# Altium project STM32C011F6U6TR SOM B'd.PrjPcb
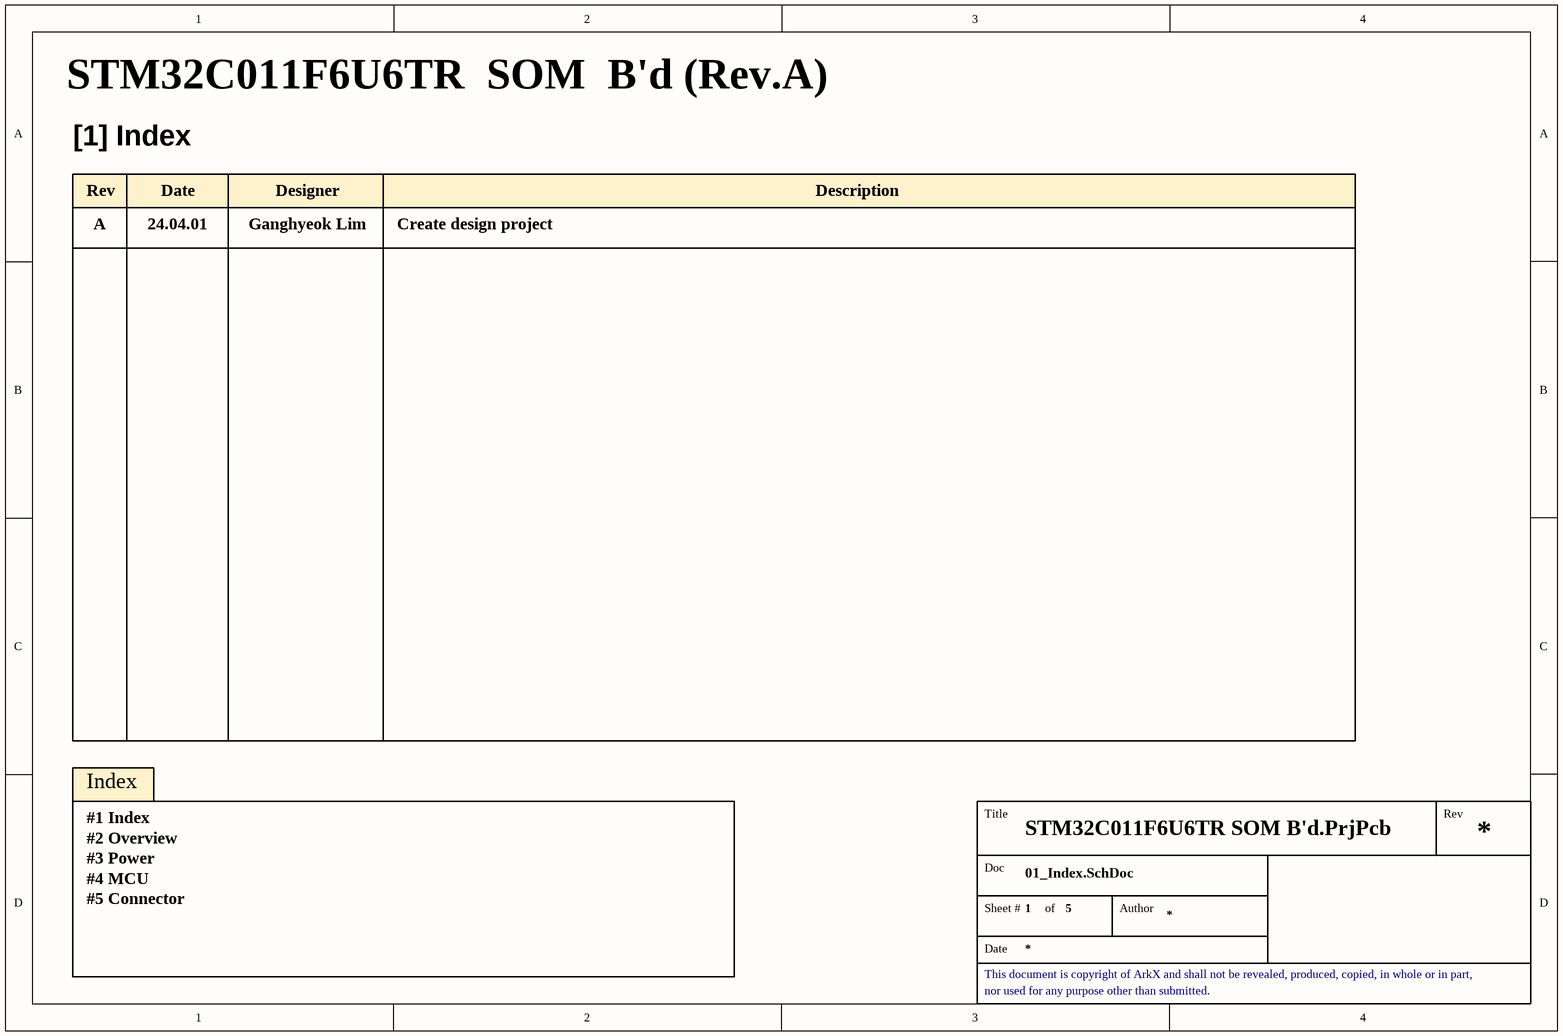
[diagram p0: 01_Index.SchDoc]
5 sheets, 42 parts. Net scope: flat (ports and power ports of the same name join across sheets).
Board file: STM32C011F6U6TR_SOM_Bd.PcbDoc
Sheets:
  01_Index.SchDoc
  02_Overview.SchDoc
  03_Power.SchDoc
  04_MCU.SchDoc
  05_Connector.SchDoc

## Sheet 01_Index.SchDoc
size A4; SheetNumber: 1; SheetTotal: 5

### Notes on the sheet
- STM32C011F6U6TR  SOM  B'd (Rev.A)
- [1] Index
- Rev
- A
- 24.04.01
- Date
- Ganghyeok Lim
- Designer
- Create design project
- Description
- Index
- #1 Index
- #2 Overview
- #3 Power
- #4 MCU
- #5 Connector
- Title
- Doc
- Sheet #
- of
- Author
- This document is copyright of ArkX and shall not be revealed, produced, copied, in whole or in part,
- nor used for any purpose other than submitted.

## Sheet 02_Overview.SchDoc
size A4; SheetNumber: 2; SheetTotal: 4
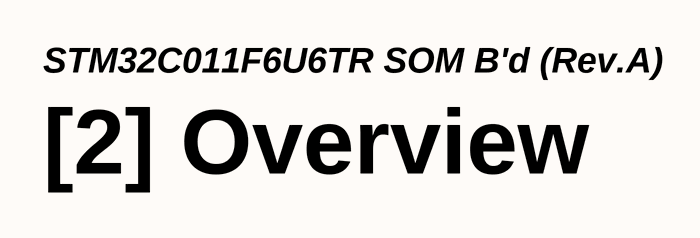
[diagram p1: 02_Overview.SchDoc]

### Notes on the sheet
- STM32C011F6U6TR SOM B'd (Rev.A)
- [2] Overview
- Title
- Rev
- Doc
- Sheet #
- of
- Author
- This document is copyright of ArkX and shall not be revealed, produced, copied, in whole or in part,
- Date
- nor used for any purpose other than submitted.

## Sheet 03_Power.SchDoc
size A4; SheetNumber: 3; SheetTotal: 5
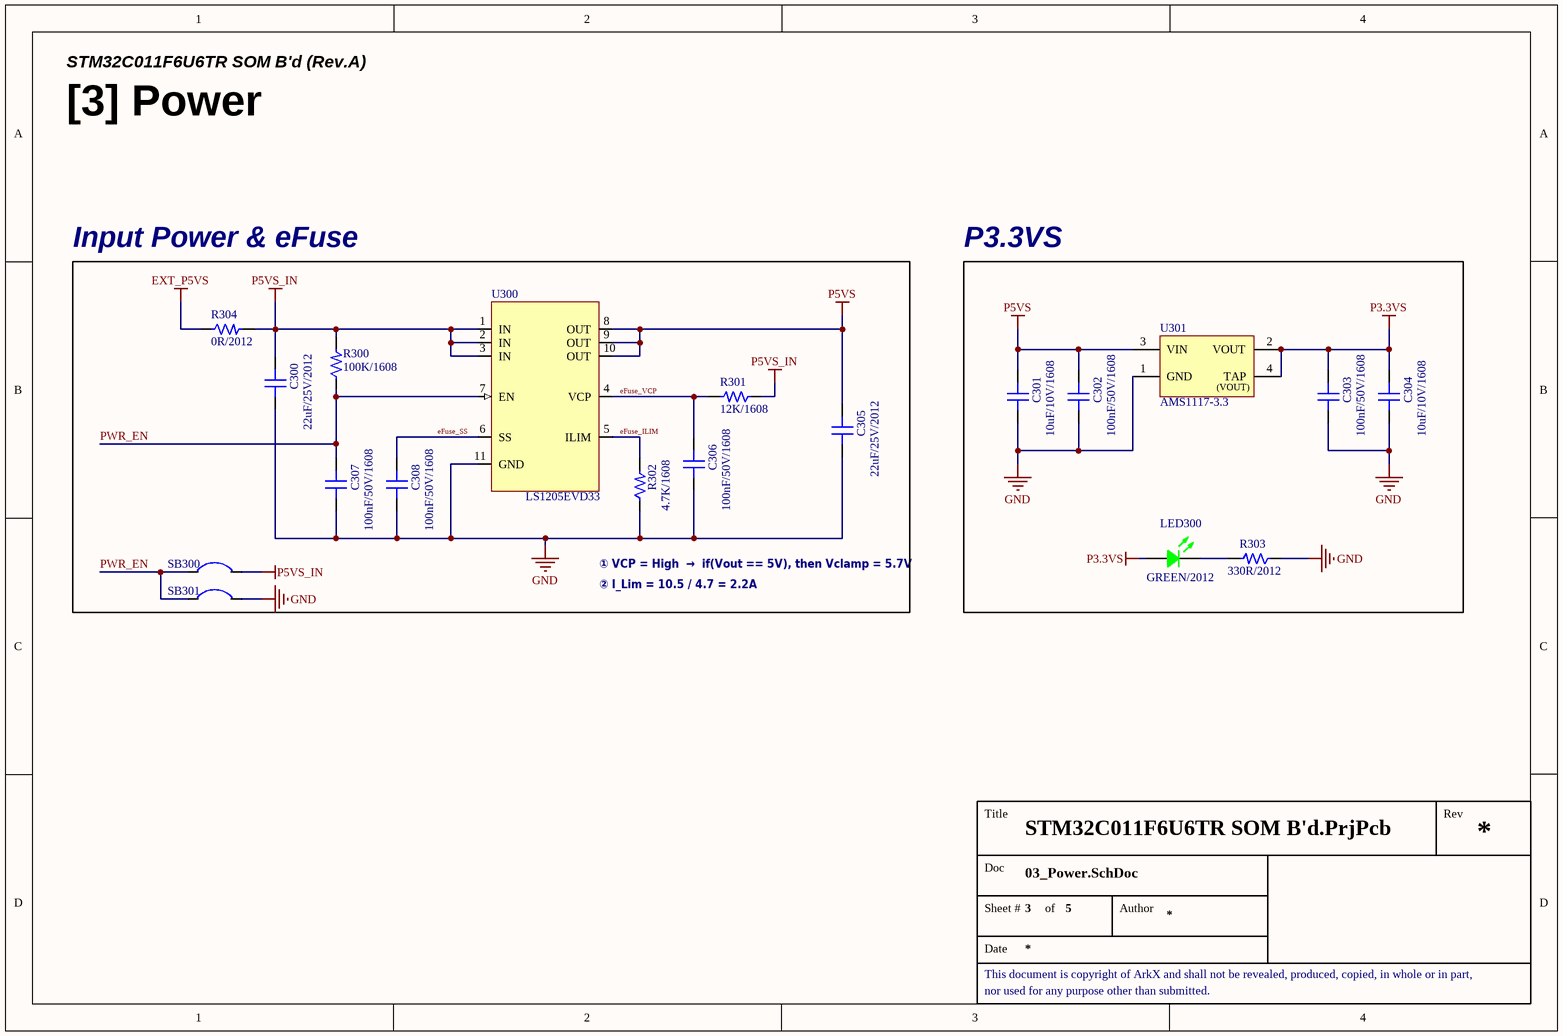
[diagram p2: 03_Power.SchDoc]

### Parts
C300  22uF/25V/2012  [CAP 2012 (0805_INCH)]
C301  10uF/10V/1608  [CAP 1608 (0603_INCH)]
C302  100nF/50V/1608  [CAP 1608 (0603_INCH)]
C303  100nF/50V/1608  [CAP 1608 (0603_INCH)]
C304  10uF/10V/1608  [CAP 1608 (0603_INCH)]
C305  22uF/25V/2012  [CAP 2012 (0805_INCH)]
C306  100nF/50V/1608  [CAP 1608 (0603_INCH)]
C307  100nF/50V/1608  [CAP 1608 (0603_INCH)]
C308  100nF/50V/1608  [CAP 1608 (0603_INCH)]
LED300  GREEN/2012  [LED MHT170RGBCT (GREEN)]
R300  100K/1608  [RES 1608 (0603_inch)]
R301  12K/1608  [RES 1608 (0603_inch)]
R302  4.7K/1608  [RES 1608 (0603_inch)]
R303  330R/2012  [RES 2012 (0805_inch)]
R304  0R/2012  [RES 2012 (0805_inch)]
SB300  SB  [SB (Solder-Bridge)]  (value not drawn)
SB301  SB  [SB (Solder-Bridge)]  (value not drawn)
U300  LS1205EVD33  [IC_DFN_3x3_10L]
U301  AMS1117-3.3  [SOT 223-3 (DIODES INCORPORATED)]

### Blocks framed on the sheet
Input Power & eFuse: C300 C305-C308 R300-R302 R304 SB300 SB301 U300
P3.3VS: C301-C304 LED300 R303 U301

### Nets
EXT_P5VS: R304.1
GND: C300.1 C301.1 C302.1 C303.1 C304.1 C305.1 C306.1 C307.1 C308.1 R302.1 R303.1 SB301.2 U300.11(GND) U301.1(GND)
P3.3VS: C303.2 C304.2 LED300.4(Common_Anode) U301.2(VOUT) U301.4(TAP)
P5VS: C301.2 C302.2 C305.2 U300.8(OUT) U300.9(OUT) U300.10(OUT) U301.3(VIN)
P5VS_IN: C300.2 R300.2 R301.1 R304.2 SB300.2 U300.1(IN) U300.2(IN) U300.3(IN)
eFuse_ILIM: R302.2 U300.5(ILIM)
eFuse_SS: C308.2 U300.6(SS)
eFuse_VCP: C306.2 R301.2 U300.4(VCP)
PWR_EN: C307.2 R300.1 SB300.1 SB301.1 U300.7(EN)
NetLED300_2: LED300.2(GREEN) R303.2

### Notes on the sheet
- STM32C011F6U6TR SOM B'd (Rev.A)
- [3] Power
- ① VCP = High  →  if(Vout == 5V), then Vclamp = 5.7V
- ② I_Lim = 10.5 / 4.7 = 2.2A
- Title
- Rev
- Doc
- Sheet #
- of
- Author
- This document is copyright of ArkX and shall not be revealed, produced, copied, in whole or in part,
- Date
- nor used for any purpose other than submitted.
- (in symbol IC_REG_AMS1117-3.3) (VOUT)

### Library data of the parts
C300 C305 = CAP_22uF/25V/2012: Ceramic CAP_22uF/25V/2012; LCSC Part #: C45783; JLCPCB Part Type: Basic Part
C301 C304 = CAP_10uF/10V/1608: Ceramic CAP_10uF/10V/1608; LCSC Part #: C19702; JLCPCB Part Type: Basic Part
C302 C303 C306-C308 = CAP_100nF/50V/1608: Ceramic CAP_100nF/50V/1608; LCSC Part #: C14663; JLCPCB Part Type: Basic Part
LED300 = LED_MHT170RGBCT(GREEN): Colorless transparence -30℃~+85℃ Positive post Common anode RGB 120° 0805  Light Emitting Diodes (LED) ROHS; LCSC Part #: C2962094; JLCPCB Part Type: Extended Part
R300 = RES_100K/1608/0.1W: Value: 100K; Power Rating: 0.1W; Precision: 1%; Size: 1608; LCSC Part #: C25803; JLCPCB Part Type: Basic Part
R301 = RES_12K/1608/0.1W: Value: 12K; Power Rating: 0.1W; Precision: 1%; Size: 1608; LCSC Part #: C22790; JLCPCB Part Type: Basic Part
R302 = RES_4.7K/1608/0.1W: Value: 4.7K; Power Rating: 0.1W; Precision: 1%; Size: 1608; LCSC Part #: C23162; JLCPCB Part Type: Basic Part
R303 = RES_330R/2012/0.125W: Value: 330R; Power Rating: 0.125W; Precision: 1%; Size: 2012; LCSC Part #: C17630; JLCPCB Part Type: Basic Part
R304 = RES_0R/2012/0.125W: Value: 0R; Power Rating: 0.1W; Precision: 1%; Size: 1608; LCSC Part #: C17477; JLCPCB Part Type: Basic Part
SB300 SB301 = SB_Solder-Bridge
U300 = IC_eFUSE_LS1205EVD33: 18V, 5A eFuse with Programmable Current Limit and Output Voltage Clamp, 10-DFN (3x3)
U301 = IC_REG_AMS1117-3.3: 72dB@(120Hz) 1A 1.3V@(800mA) Fixed 3.3V~3.3V Positive 1 SOT-223  Linear Voltage Regulators (LDO) ROHS; LCSC Part #: C6186; JLCPCB Part Type: Basic Part

## Sheet 04_MCU.SchDoc
size A4; SheetNumber: 4; SheetTotal: 5
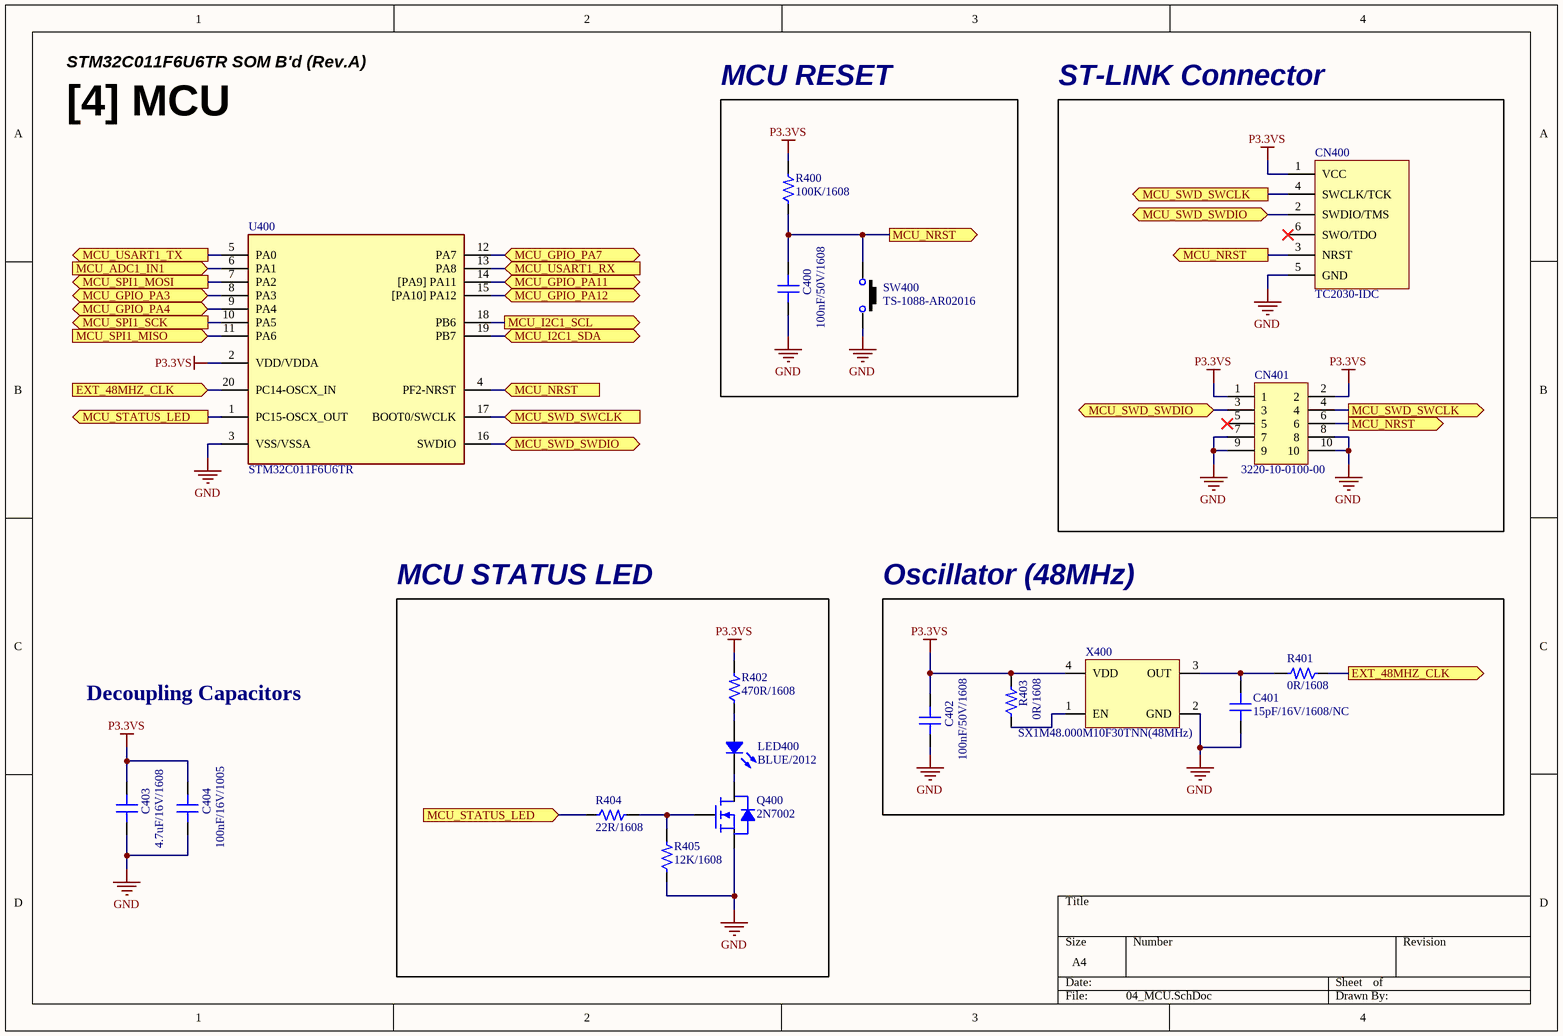
[diagram p3: 04_MCU.SchDoc]

### Parts
C400  100nF/50V/1608  [CAP 1608 (0603_INCH)]
C401  15pF/16V/1608/NC  [CAP 1608 (0603_INCH)/NC]
C402  100nF/50V/1608  [CAP 1608 (0603_INCH)]
C403  4.7uF/16V/1608  [CAP 1608 (0603_INCH)]
C404  100nF/16V/1005  [CAP 1005 (0402_INCH)]
CN400  TC2030-IDC  [CON_TC2030-FP]  (no BOM)
CN401  3220-10-0100-00  [CON 3220-10-0100-00 (Hand_Solder)]
LED400  BLUE/2012  [LED MHT170RGBCT (BLUE)]
Q400  2N7002  [SOT 23-3 (DIODES INCORPORATED)]
R400  100K/1608  [RES 1608 (0603_inch)]
R401  0R/1608  [RES 1608 (0603_inch)]
R402  470R/1608  [RES 1608 (0603_inch)]
R403  0R/1608  [RES 1608 (0603_inch)]
R404  22R/1608  [RES 1608 (0603_inch)]
R405  12K/1608  [RES 1608 (0603_inch)]
SW400  TS-1088-AR02016  [SW_TS-1088-AR02016]
U400  STM32C011F6U6TR  [IC_UFQFPN-20]
X400  SX1M48.000M10F30TNN(48MHz)  [OSC_SMD2016-4P]

### Blocks framed on the sheet
MCU RESET: C400 R400 SW400
ST-LINK Connector: CN400 CN401
MCU STATUS LED: LED400 Q400 R402 R404 R405
Oscillator (48MHz): C401 C402 R401 R403 X400

### Ports
EXT_48MHZ_CLK (in), EXT_48MHZ_CLK (out), MCU_ADC1_IN1 (in), MCU_GPIO_PA3 (bidir), MCU_GPIO_PA4 (bidir), MCU_GPIO_PA7 (bidir), MCU_GPIO_PA11 (bidir), MCU_GPIO_PA12 (bidir), MCU_I2C1_SCL (out), MCU_I2C1_SDA (bidir), MCU_NRST (in), MCU_NRST (out), MCU_SPI1_MISO (in), MCU_SPI1_MOSI (out), MCU_SPI1_SCK (out), MCU_STATUS_LED (in), MCU_STATUS_LED (out), MCU_SWD_SWCLK (in), MCU_SWD_SWCLK (out), MCU_SWD_SWDIO (bidir), MCU_USART1_RX (in), MCU_USART1_TX (out)

### Nets
GND: C400.1 C401.1 C402.1 C403.1 C404.1 CN400.5(GND) CN401.7 CN401.8 CN401.9 CN401.10 Q400.2(S) R405.1 SW400.2 U400.3(VSS/VSSA) X400.2(GND)
P3.3VS: C402.2 C403.2 C404.2 CN400.1(VCC) CN401.1 CN401.2 R400.2 R402.2 R403.2 U400.2(VDD/VDDA) X400.4(VDD)
EXT_48MHZ_CLK: R401.1 U400.20(PC14-OSCX_IN) ; port EXT_48MHZ_CLK
MCU_ADC1_IN1: U400.6(PA1) ; port MCU_ADC1_IN1
MCU_GPIO_PA3: U400.8(PA3) ; port MCU_GPIO_PA3
MCU_GPIO_PA4: U400.9(PA4) ; port MCU_GPIO_PA4
MCU_GPIO_PA7: U400.12(PA7) ; port MCU_GPIO_PA7
MCU_GPIO_PA11: U400.14([PA9]_PA11) ; port MCU_GPIO_PA11
MCU_GPIO_PA12: U400.15([PA10]_PA12) ; port MCU_GPIO_PA12
MCU_I2C1_SCL: U400.18(PB6) ; port MCU_I2C1_SCL
MCU_I2C1_SDA: U400.19(PB7) ; port MCU_I2C1_SDA
MCU_NRST: C400.2 CN400.3(NRST) CN401.6 R400.1 SW400.1 U400.4(PF2-NRST) ; port MCU_NRST
MCU_SPI1_MISO: U400.11(PA6) ; port MCU_SPI1_MISO
MCU_SPI1_MOSI: U400.7(PA2) ; port MCU_SPI1_MOSI
MCU_SPI1_SCK: U400.10(PA5) ; port MCU_SPI1_SCK
MCU_STATUS_LED: R404.1 U400.1(PC15-OSCX_OUT) ; port MCU_STATUS_LED
MCU_SWD_SWCLK: CN400.4(SWCLK/TCK) CN401.4 U400.17(BOOT0/SWCLK) ; port MCU_SWD_SWCLK
MCU_SWD_SWDIO: CN400.2(SWDIO/TMS) CN401.3 U400.16(SWDIO) ; port MCU_SWD_SWDIO
MCU_USART1_RX: U400.13(PA8) ; port MCU_USART1_RX
MCU_USART1_TX: U400.5(PA0) ; port MCU_USART1_TX
NetC401_2: C401.2 R401.2 X400.3(OUT)
NetLED400_3: LED400.3(BLUE) Q400.3(D)
NetLED400_4: LED400.4(Common_Anode) R402.1
NetQ400_1: Q400.1(G) R404.2 R405.2
NetR403_1: R403.1 X400.1(EN)

Not connected (* = marked no-connect by the designer): CN400 6(SWO/TDO)*; CN401 5*

### Notes on the sheet
- STM32C011F6U6TR SOM B'd (Rev.A)
- [4] MCU
- Decoupling Capacitors

### Library data of the parts
C400 C402 = CAP_100nF/50V/1608: Ceramic CAP_100nF/50V/1608; LCSC Part #: C14663; JLCPCB Part Type: Basic Part
C401 = CAP_NC_15pF/16V/1608: Ceramic CAP_15pF/16V/1608
C403 = CAP_4.7uF/16V/1608: Ceramic CAP_4.7uF/16V/1608; LCSC Part #: C19666; JLCPCB Part Type: Basic Part
C404 = CAP_100nF/16V/1005: Ceramic CAP_100nF/16V/1005; LCSC Part #: C1525; JLCPCB Part Type: Basic Part
CN400 = CON_TC2030-IDC: Tag-Connect No-Solder SWD Debug Connector DO NOT PLACE; Manufacturer Part Number: TC2030; Manufacturer: Tag-Connect
CN401 = CON_IDC_3220-10-0100-00: CONN HEADER VERT 10POS 1.27MM
LED400 = LED_MHT170RGBCT(BLUE): Colorless transparence -30℃~+85℃ Positive post Common anode RGB 120° 0805  Light Emitting Diodes (LED) ROHS; LCSC Part #: C2962094; JLCPCB Part Type: Extended Part
Q400 = FET_2N7002: 60V 115mA 200mW 7.5Ω@10V,500mA N Channel SOT-23  MOSFETs ROHS; LCSC Part #: C8545; JLCPCB Part Type: Basic Part
R400 = RES_100K/1608/0.1W: as R300 on sheet 03_Power; Size: 1608; LCSC Part #: C25803; JLCPCB Part Type: Basic Part
R401 R403 = RES_0R/1608/0.1W: Value: 0R; Power Rating: 0.1W; Precision: 1%; Size: 1608; LCSC Part #: C21189; JLCPCB Part Type: Basic Part
R402 = RES_470R/1608/0.1W: Value: 470R; Power Rating: 0.1W; Precision: 1%; Size: 1608; LCSC Part #: C23179; JLCPCB Part Type: Basic Part
R404 = RES_22R/1608/0.1W: Value: 22R; Power Rating: 0.1W; Precision: 1%; Size: 1608; LCSC Part #: C23345; JLCPCB Part Type: Basic Part
R405 = RES_12K/1608/0.1W: as R301 on sheet 03_Power; Size: 1608; LCSC Part #: C22790; JLCPCB Part Type: Basic Part
SW400 = SW_TS-1088-AR02016: NO 50mA 100MΩ 100000 Times 12V 160gf@±50gf Brick nogging SPST SMD  Tactile Switches ROHS; LCSC Part #: C720477; JLCPCB Part Type: Extended Part
U400 = IC_MCU_STM32C011F6U6TR: ARM® Cortex®-M0+ STM32C0 Microcontroller IC 32-Bit 48MHz 32KB (32K x 8) FLASH 20-UFQFPN (3x3); Manufacturer: STMicroelectronics; Manufacturer Part Number: STM32C011F6U6TR; Case/Package: UFQFPN20; LCSC Part #: C5456206; JLCPCB Part Type: Extended Part
X400 = OSC_SX1M48.000M10F30TNN(48MHz): 1.62V~3.63V ±10ppm CMOS 48MHz SMD2016-4P  Oscillators ROHS; LCSC Part #: C2901617; JLCPCB Part Type: Extended Part

## Sheet 05_Connector.SchDoc
size A4; SheetNumber: 5; SheetTotal: 5
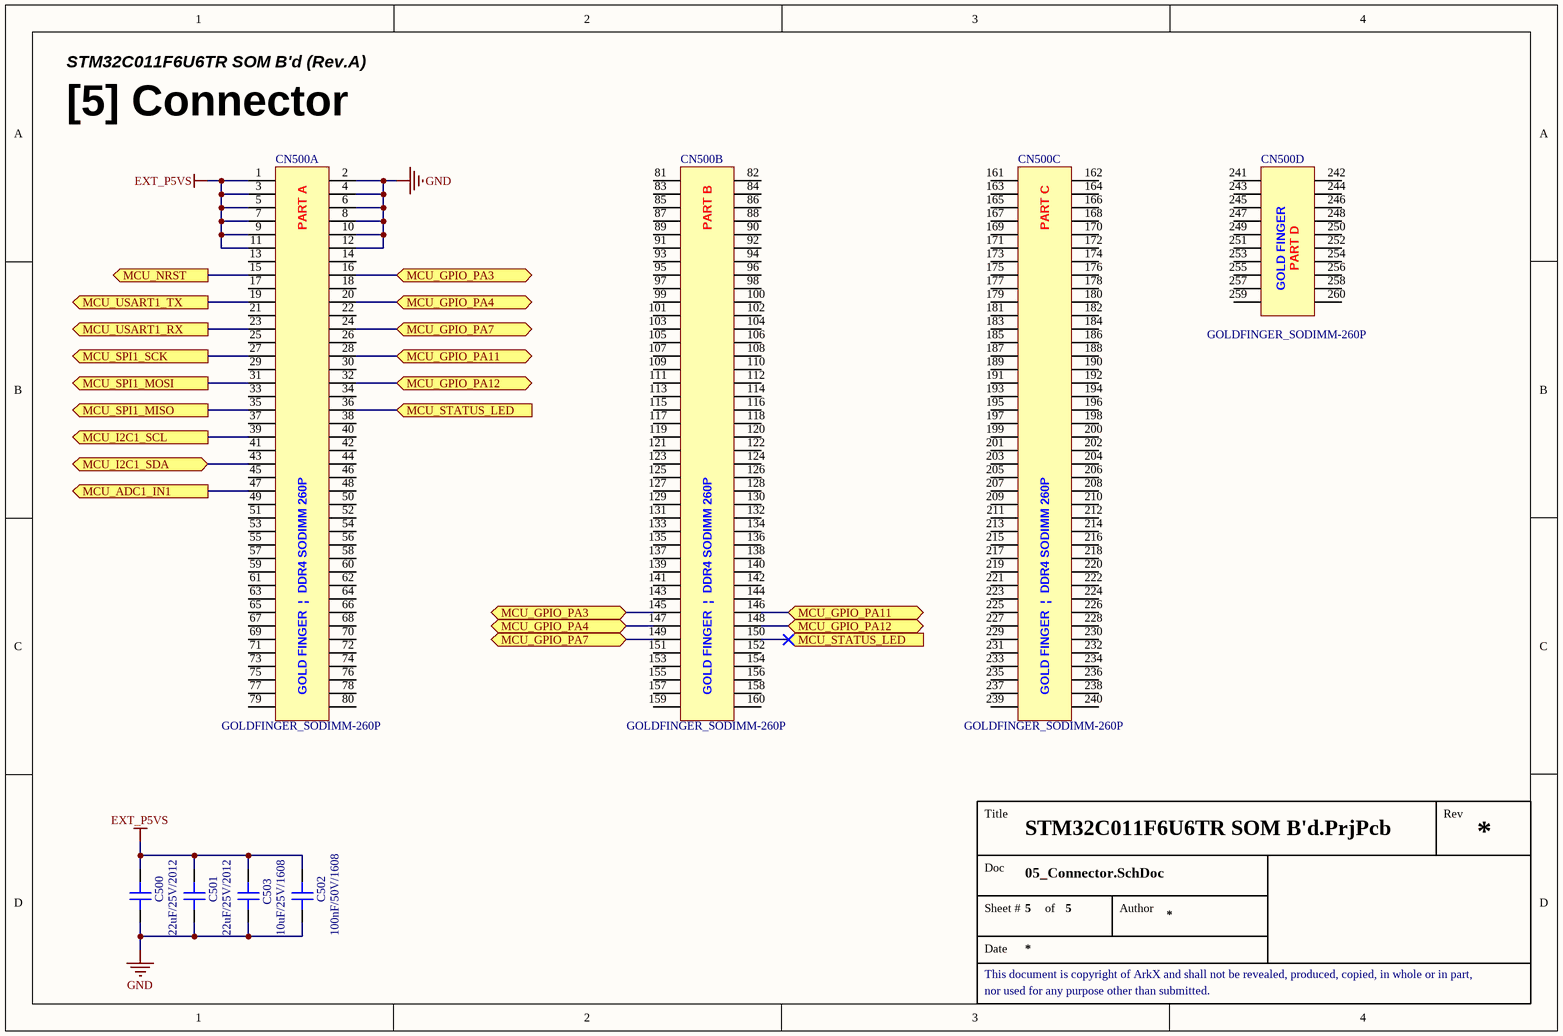
[diagram p4: 05_Connector.SchDoc]

### Parts
C500  22uF/25V/2012  [CAP 2012 (0805_INCH)]
C501  22uF/25V/2012  [CAP 2012 (0805_INCH)]
C502  100nF/50V/1608  [CAP 1608 (0603_INCH)]
C503  10uF/25V/1608  [CAP 1608 (0603_INCH)]
CN500  GOLDFINGER_SODIMM-260P  [CON_DDR4-SODIMM-260P_EDGE-CONNECTOR]  (parts A,B,C,D of 4)

### Ports
MCU_ADC1_IN1 (out), MCU_GPIO_PA3 (bidir), MCU_GPIO_PA4 (bidir), MCU_GPIO_PA7 (bidir), MCU_GPIO_PA11 (bidir), MCU_GPIO_PA12 (bidir), MCU_I2C1_SCL (out), MCU_I2C1_SDA (bidir), MCU_NRST (out), MCU_SPI1_MISO (out), MCU_SPI1_MOSI (out), MCU_SPI1_SCK (out), MCU_STATUS_LED (in), MCU_USART1_RX (out), MCU_USART1_TX (out)

### Nets
EXT_P5VS: C500.2 C501.2 C502.2 C503.2 CN500.1 CN500.3 CN500.5 CN500.7 CN500.9 CN500.11
GND: C500.1 C501.1 C502.1 C503.1 CN500.2 CN500.4 CN500.6 CN500.8 CN500.10 CN500.12
MCU_ADC1_IN1: CN500.47 ; port MCU_ADC1_IN1
MCU_GPIO_PA3: CN500.16 CN500.145 ; port MCU_GPIO_PA3
MCU_GPIO_PA4: CN500.20 CN500.147 ; port MCU_GPIO_PA4
MCU_GPIO_PA7: CN500.24 CN500.149 ; port MCU_GPIO_PA7
MCU_GPIO_PA11: CN500.28 CN500.146 ; port MCU_GPIO_PA11
MCU_GPIO_PA12: CN500.32 CN500.148 ; port MCU_GPIO_PA12
MCU_I2C1_SCL: CN500.39 ; port MCU_I2C1_SCL
MCU_I2C1_SDA: CN500.43 ; port MCU_I2C1_SDA
MCU_NRST: CN500.15 ; port MCU_NRST
MCU_SPI1_MISO: CN500.35 ; port MCU_SPI1_MISO
MCU_SPI1_MOSI: CN500.31 ; port MCU_SPI1_MOSI
MCU_SPI1_SCK: CN500.27 ; port MCU_SPI1_SCK
MCU_STATUS_LED: CN500.36 CN500.150 ; port MCU_STATUS_LED
MCU_USART1_RX: CN500.23 ; port MCU_USART1_RX
MCU_USART1_TX: CN500.19 ; port MCU_USART1_TX

Not connected (* = marked no-connect by the designer): CN500 13 14 17 18 21 22 25 26 29 30 33 34 37 38 40 41 42 44 45 46 48 49 50 51 52 53 54 55 56 57 58 59 60 61 62 63 64 65 66 67 68 69 70 71 72 73 74 75 76 77 78 79 80 81 82 83 84 85 86 87 88 89 90 91 92 93 94 95 96 97 98 99 100 101 102 103 104 105 106 107 108 109 110 111 112 113 114 115 116 117 118 119 120 121 122 123 124 125 126 127 128 129 130 131 132 133 134 135 136 137 138 139 140 141 142 143 144 151 152 153 154 155 156 157 158 159 160 161 162 163 164 165 166 167 168 169 170 171 172 173 174 175 176 177 178 179 180 181 182 183 184 185 186 187 188 189 190 191 192 193 194 195 196 197 198 199 200 201 202 203 204 205 206 207 208 209 210 211 212 213 214 215 216 217 218 219 220 221 222 223 224 225 226 227 228 229 230 231 232 233 234 235 236 237 238 239 240 241 242 243 244 245 246 247 248 249 250 251 252 253 254 255 256 257 258 259 260

### Notes on the sheet
- STM32C011F6U6TR SOM B'd (Rev.A)
- [5] Connector
- Title
- Rev
- Doc
- Sheet #
- of
- Author
- This document is copyright of ArkX and shall not be revealed, produced, copied, in whole or in part,
- Date
- nor used for any purpose other than submitted.
- (in symbol CON_GOLD-FINGER_DDR4-SODIMM-260P, part A) PART A; GOLD FINGER  |  DDR4 SODIMM 260P
- (in symbol CON_GOLD-FINGER_DDR4-SODIMM-260P, part B) PART B; GOLD FINGER  |  DDR4 SODIMM 260P
- (in symbol CON_GOLD-FINGER_DDR4-SODIMM-260P, part C) PART C; GOLD FINGER  |  DDR4 SODIMM 260P
- (in symbol CON_GOLD-FINGER_DDR4-SODIMM-260P, part D) GOLD FINGER; PART D

### Library data of the parts
C500 C501 = CAP_22uF/25V/2012: Ceramic CAP_22uF/25V/2012; LCSC Part #: C45783; JLCPCB Part Type: Basic Part
C502 = CAP_100nF/50V/1608: Ceramic CAP_100nF/50V/1608; LCSC Part #: C14663; JLCPCB Part Type: Basic Part
C503 = CAP_10uF/25V/1608: Ceramic CAP_10uF/25V/1608; LCSC Part #: C96446; JLCPCB Part Type: Basic Part
CN500 = CON_GOLD-FINGER_DDR4-SODIMM-260P: GOLD-FINGER_DDR4-SODIMM-260P; Mating Part Number: 2309409-1

## Nets that join several sheets
EXT_P5VS: 03_Power (R304.1), 05_Connector (10 pins)
GND: 03_Power (14 pins), 04_MCU (15 pins), 05_Connector (10 pins)
P3.3VS: 03_Power (5 pins), 04_MCU (11 pins)
MCU_ADC1_IN1: 04_MCU (U400.6), 05_Connector (CN500.47)
MCU_GPIO_PA3: 04_MCU (U400.8), 05_Connector (CN500.16 CN500.145)
MCU_GPIO_PA4: 04_MCU (U400.9), 05_Connector (CN500.20 CN500.147)
MCU_GPIO_PA7: 04_MCU (U400.12), 05_Connector (CN500.24 CN500.149)
MCU_GPIO_PA11: 04_MCU (U400.14), 05_Connector (CN500.28 CN500.146)
MCU_GPIO_PA12: 04_MCU (U400.15), 05_Connector (CN500.32 CN500.148)
MCU_I2C1_SCL: 04_MCU (U400.18), 05_Connector (CN500.39)
MCU_I2C1_SDA: 04_MCU (U400.19), 05_Connector (CN500.43)
MCU_NRST: 04_MCU (6 pins), 05_Connector (CN500.15)
MCU_SPI1_MISO: 04_MCU (U400.11), 05_Connector (CN500.35)
MCU_SPI1_MOSI: 04_MCU (U400.7), 05_Connector (CN500.31)
MCU_SPI1_SCK: 04_MCU (U400.10), 05_Connector (CN500.27)
MCU_STATUS_LED: 04_MCU (R404.1 U400.1), 05_Connector (CN500.36 CN500.150)
MCU_USART1_RX: 04_MCU (U400.13), 05_Connector (CN500.23)
MCU_USART1_TX: 04_MCU (U400.5), 05_Connector (CN500.19)